# EAGLE design comparator-denary-buffer (EAGLE 9.6.1)
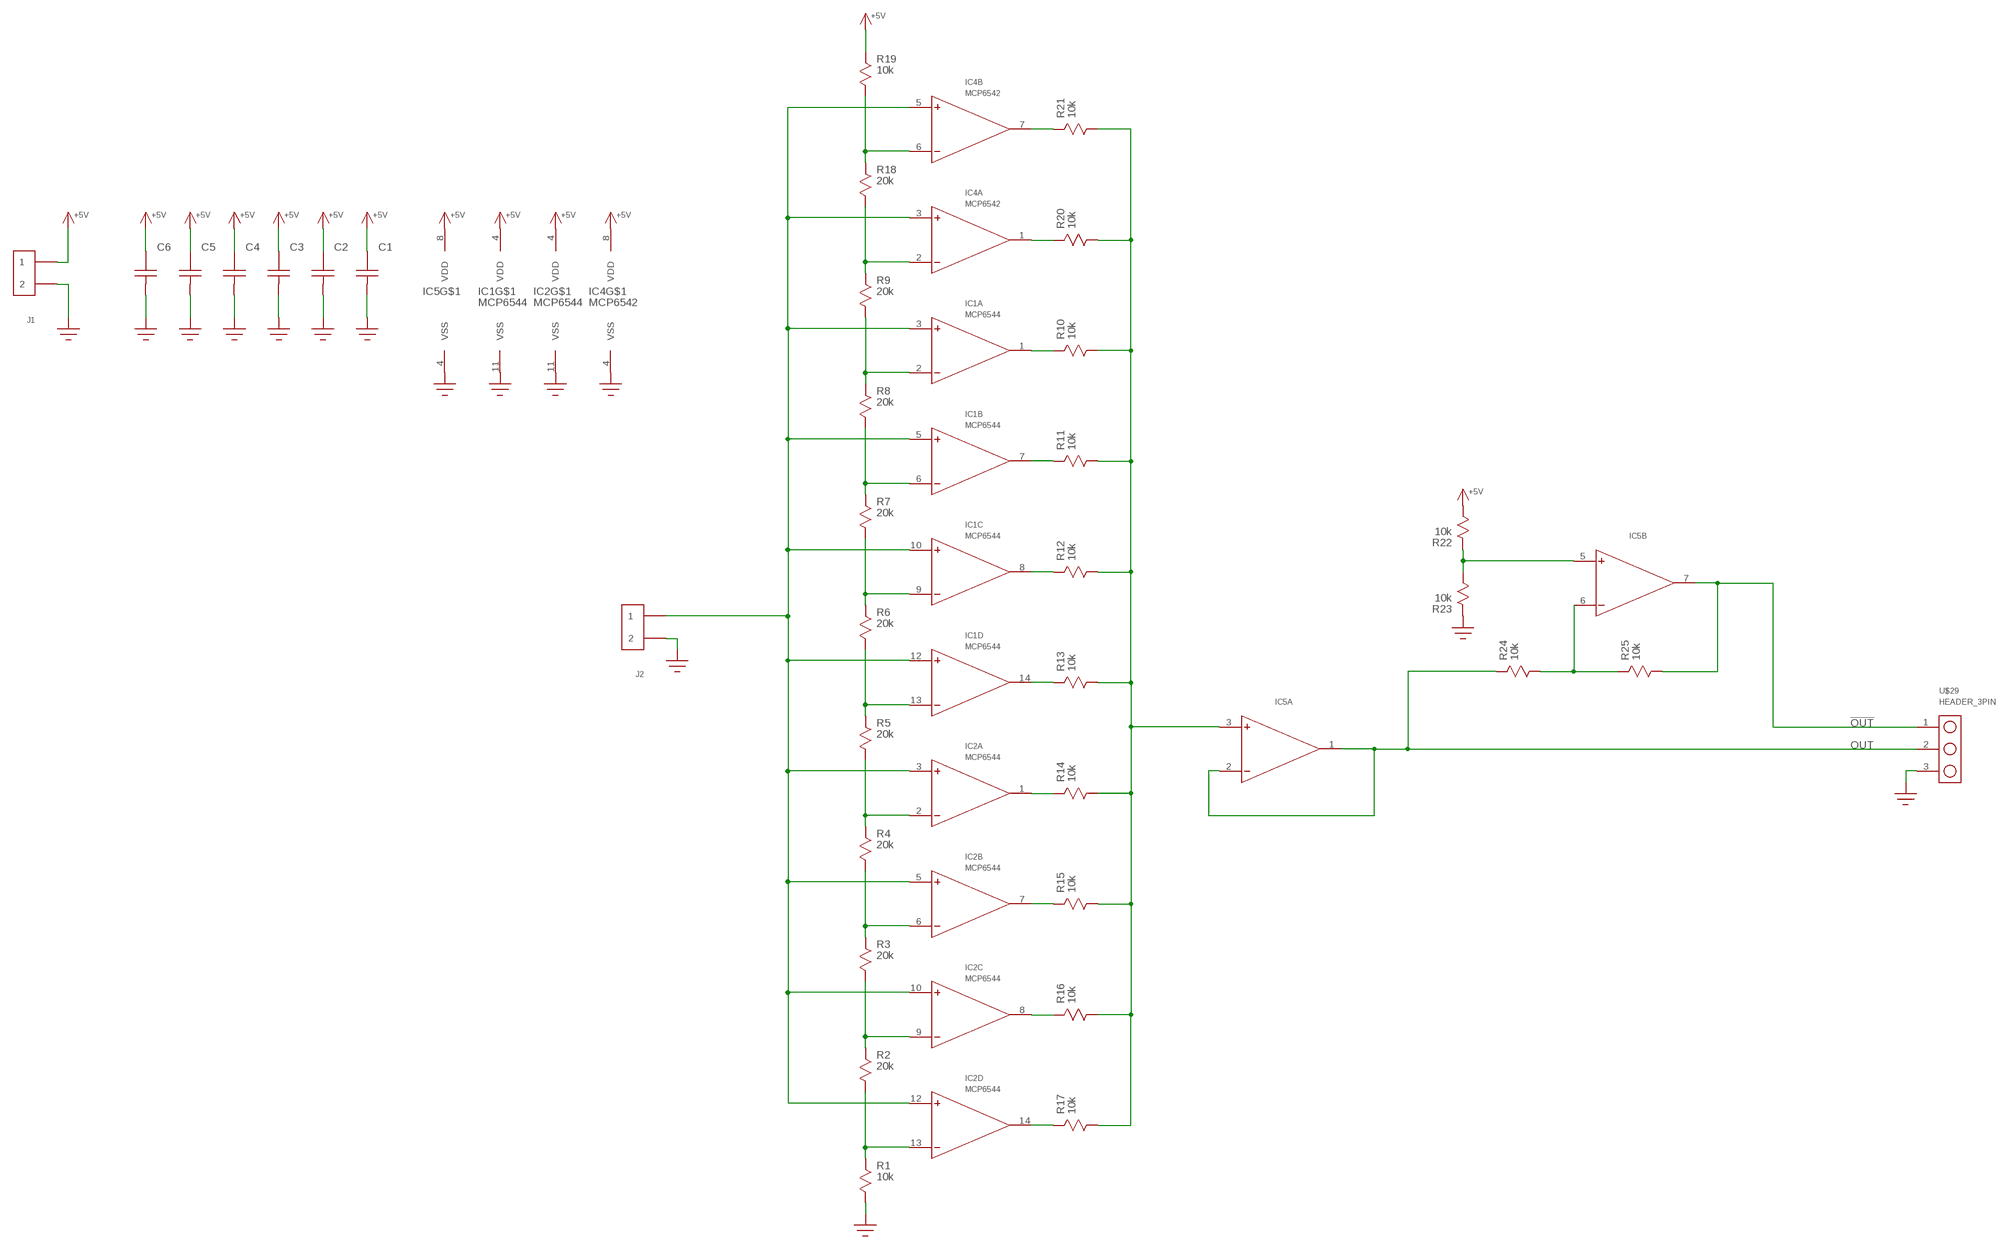
[diagram p0: schematic, sheet 1]

## Parts
C1  C0603  [C0603]
C2  C0603  [C0603]
C3  C0603  [C0603]
C4  C0603  [C0603]
C5  C0603  [C0603]
C6  C1206  [1206]
IC1  MCP6544  MCP6544SOIC  [SOIC-14]
IC2  MCP6544  MCP6544SOIC  [SOIC-14]
IC4  MCP6542  [SOIC8]
IC5  MCP6L02  [SOIC8]
J1  HEADER_2PIN  [HEADER_2PIN]
J2  HEADER_2PIN  [HEADER_2PIN]
R1  10k  R0603  [R0603]
R2  20k  R0603  [R0603]
R3  20k  R0603  [R0603]
R4  20k  R0603  [R0603]
R5  20k  R0603  [R0603]
R6  20k  R0603  [R0603]
R7  20k  R0603  [R0603]
R8  20k  R0603  [R0603]
R9  20k  R0603  [R0603]
R10  10k  R0603  [R0603]
R11  10k  R0603  [R0603]
R12  10k  R0603  [R0603]
R13  10k  R0603  [R0603]
R14  10k  R0603  [R0603]
R15  10k  R0603  [R0603]
R16  10k  R0603  [R0603]
R17  10k  R0603  [R0603]
R18  20k  R0603  [R0603]
R19  10k  R0603  [R0603]
R20  10k  R0603  [R0603]
R21  10k  R0603  [R0603]
R22  10k  R0603  [R0603]
R23  10k  R0603  [R0603]
R24  10k  R0603  [R0603]
R25  10k  R0603  [R0603]
U$29  HEADER_3PIN  [HEADER_3PIN]

## Nets
!OUT!: IC5.7(B:OUT) R25.P$2 U$29.1
+5V: C1.P$2 C2.P$2 C3.P$2 C4.P$2 C5.P$2 C6.P$2 IC1.4(VDD) IC2.4(VDD) IC4.8(VDD) IC5.8(VDD) J1.1 R19.P$1 R22.P$2
GND: C1.P$1 C2.P$1 C3.P$1 C4.P$1 C5.P$1 C6.P$1 IC1.11(VSS) IC2.11(VSS) IC4.4(VSS) IC5.4(VSS) J1.2 J2.2 R1.P$2 R23.P$1 U$29.3
N$1: IC2.13(D:-) R1.P$1 R2.P$2
N$2: IC2.14(D:OUT) R17.P$1
N$3: IC2.9(C:-) R2.P$1 R3.P$2
N$4: IC2.8(C:OUT) R16.P$1
N$5: IC2.6(B:-) R3.P$1 R4.P$2
N$6: IC2.2(A:-) R4.P$1 R5.P$2
N$7: IC1.13(D:-) R5.P$1 R6.P$2
N$8: IC1.9(C:-) R6.P$1 R7.P$2
N$9: IC1.6(B:-) R7.P$1 R8.P$2
N$10: IC2.7(B:OUT) R15.P$1
N$11: IC2.1(A:OUT) R14.P$1
N$13: IC1.14(D:OUT) R13.P$1
N$14: IC1.8(C:OUT) R12.P$1
N$15: IC1.2(A:-) R8.P$1 R9.P$2
N$16: IC1.7(B:OUT) R11.P$1
N$17: IC1.1(A:OUT) R10.P$1
N$19: IC5.3(A:+) R10.P$2 R11.P$2 R12.P$2 R13.P$2 R14.P$2 R15.P$2 R16.P$2 R17.P$2 R20.P$2 R21.P$2
N$20: IC4.2(A:-) R9.P$1 R18.P$2
N$21: IC4.6(B:-) R18.P$1 R19.P$2
N$22: IC4.7(B:OUT) R21.P$1
N$23: IC4.1(A:OUT) R20.P$1
N$24: IC5.5(B:+) R22.P$1 R23.P$2
N$25: IC5.6(B:-) R24.P$2 R25.P$1
OUT: IC5.1(A:OUT) IC5.2(A:-) R24.P$1 U$29.2
VIN: IC1.3(A:+) IC1.5(B:+) IC1.10(C:+) IC1.12(D:+) IC2.3(A:+) IC2.5(B:+) IC2.10(C:+) IC2.12(D:+) IC4.3(A:+) IC4.5(B:+) J2.1

## Library data of the parts
C1-C6 = yapo:C
IC1 IC2 = yapo:MCP6544
IC4 = yapo:MCP6542
IC5 = yapo:MCP6L02
J1 J2 = yapo:HEADER_2PIN
R1-R25 = yapo:R
U$29 = yapo:HEADER_3PIN

## Board
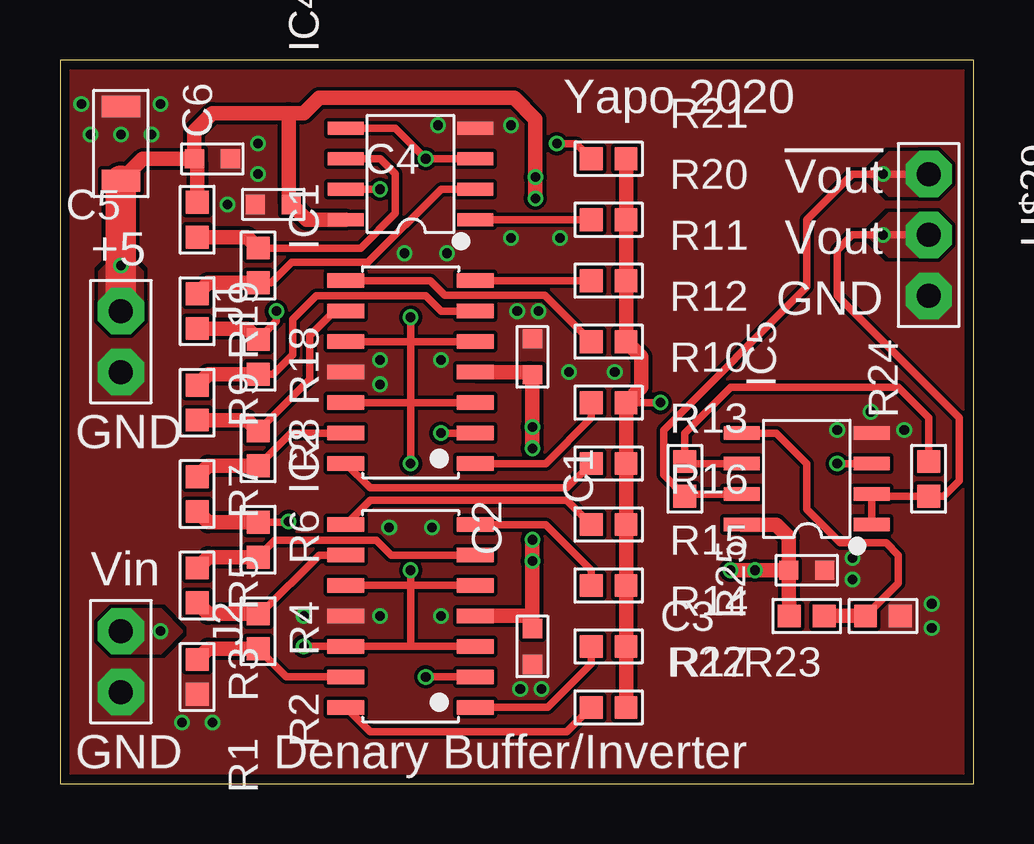
[diagram p1: board, top side]
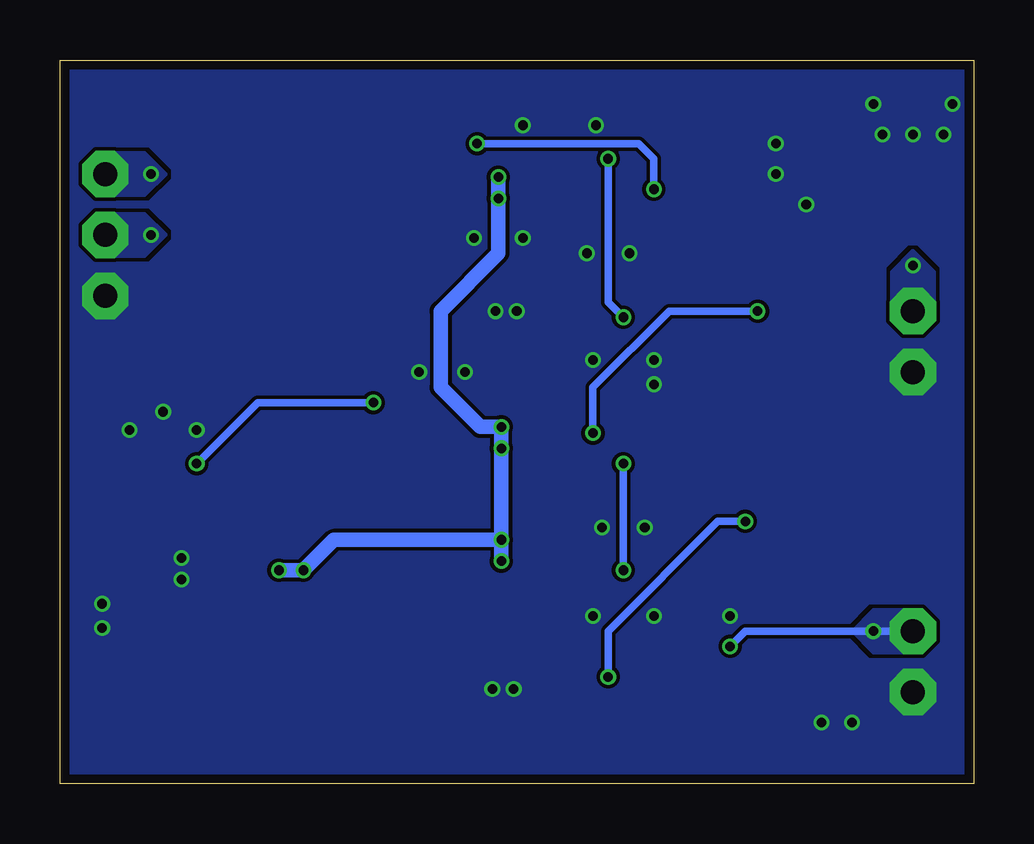
[diagram p2: board, bottom side, seen from below]

Size 38.08 x 30.15 mm. Coordinates in mm from the lower left corner, seen from the top.
Outline: 0,0 38.08,0 38.08,30.15 0,30.15 0,0
Copper layers (1*16): Top 0.035559375mm / dielectric 1.6mm / Bottom 0.035559375mm
Design rules "oshpark-2layer *": minimum track width 6mil, minimum drill 10mil, track to track 6mil, track to pad 6mil, pad to pad 6mil, via to via 6mil, smd to smd 6mil, copper to edge 15mil, drill to drill 6mil, minimum pad ring 5mil, minimum via ring 5mil, stop-mask expansion 2.5mil, vias tented up to drill 20mil, thermal gap 10mil

### Footprints (pad centres in the part's own frame; a part is rotated, then mirrored left to right if it is on the bottom)
C0603 = smd 0.8 x 0.8: P$1 -0.75,0; P$2 0.75,0
1206 = smd 0.9 x 1.6: P$1 -1.55,0; P$2 1.55,0
SOIC-14 = smd 0.6 x 1.55: 1 -3.81,-2.7; 2 -2.54,-2.7; 3 -1.27,-2.7; 4 0,-2.7; 5 1.27,-2.7; 6 2.54,-2.7; 7 3.81,-2.7; 8 3.81,2.7; 9 2.54,2.7; 10 1.27,2.7; 11 0,2.7; 12 -1.27,2.7; 13 -2.54,2.7; 14 -3.81,2.7
SOIC8 = smd 0.55 x 1.5: 1 -1.905,-2.7; 2 -0.635,-2.7; 3 0.635,-2.7; 4 1.905,-2.7; 5 1.905,2.7; 6 0.635,2.7; 7 -0.635,2.7; 8 -1.905,2.7
HEADER_2PIN = drill 1 pad 1.93 octagon: 1 -1.27,0; 2 1.27,0
R0603 = smd 0.95 x 0.95: P$1 -0.725,0; P$2 0.725,0
HEADER_3PIN = drill 1 pad 1.93 octagon: 1 -2.54,0; 2 0,0; 3 2.54,0

### Placement (x,y rotation side)
C1  19.68,17.78 270 top
C2  19.68,5.71 90 top
C3  31.11,8.89 180 top
C4  8.89,24.13 0 top
C5  6.35,26.04 180 top
C6  2.54,26.67 270 top
IC1  14.61,17.14 90 top
IC2  14.61,6.99 90 top
IC4  14.61,25.4 90 top
IC5  31.11,12.7 90 top
J1  2.54,18.41 270 top
J2  2.54,5.08 270 top
R1  5.71,4.45 270 top
R2  8.26,6.35 270 top
R3  5.71,8.26 270 top
R4  8.26,10.16 270 top
R5  5.71,12.06 270 top
R6  8.26,13.97 270 top
R7  5.71,15.88 270 top
R8  8.26,17.78 270 top
R9  5.71,19.68 270 top
R10  22.86,15.88 0 top
R11  22.86,20.95 0 top
R12  22.86,18.41 0 top
R13  22.86,13.34 0 top
R14  22.86,5.71 0 top
R15  22.86,8.26 0 top
R16  22.86,10.79 0 top
R17  22.86,3.17 0 top
R18  8.26,21.59 270 top
R19  5.71,23.5 270 top
R20  22.86,23.5 0 top
R21  22.86,26.04 0 top
R22  31.11,6.99 180 top
R23  34.29,6.99 180 top
R24  36.2,12.7 90 top
R25  26.04,12.7 270 top
U$29  36.2,22.86 270 top

### Tracks (layer width: path | path; a pad name or v marks a point on that pad's centre or on a via)
!OUT!  (via drill 0.4)
  Top 0.305: IC5.7 26.12,12.06 R25.P$2 25.15,12.86 25.15,14.73 31.11,20.7 31.11,23.5 33.02,25.4 v34.29,25.4 U$29.1
  pour Top (no thermals): 36.2,26.29 34.54,26.29 33.66,25.4 34.54,24.51 36.2,24.51
  pour Bottom (no thermals): 36.2,26.29 34.54,26.29 33.66,25.4 34.54,24.51 36.2,24.51
+5V  (via drill 0.4)
  Top 0.61: IC1.4 19.57,17.14 C1.P$2 v19.68,13.97 | IC2.4 19.66,6.99 C2.P$2 v19.68,10.16 | IC4.8 10.28,23.5 C4.P$2 9.53,24.25 9.53,27.94 | C5.P$2 5.71,25.92 R19.P$1 | C5.P$2 5.6,27.19 6.35,27.94 9.53,27.94 | 9.53,27.94 10.16,27.94 10.79,28.57 18.92,28.57 19.81,27.69 v19.81,24.38 | C6.P$2 3.46,26.04 C5.P$2 | C3.P$2 30.36,10.28 29.84,10.79 IC5.8 | C3.P$2 30.36,7.67 30.39,7.64 R22.P$2 | v27.94,8.89 C3.P$2
  Top 1.27: J1.1 v2.54,21.59 C6.P$2
  Bottom 0.61: v19.68,10.16 v19.68,13.97 v19.68,14.86 20.57,14.86 22.23,16.51 22.23,19.68 19.81,22.1 v19.81,24.38 v19.81,25.27 | v19.68,10.16 v19.68,9.27 | v19.68,10.16 26.67,10.16 v27.94,8.89 v28.96,8.89
  pour Top (no thermals): 1.65,19.68 1.65,21.34 2.54,22.23 3.43,21.34 3.43,19.68
  pour Bottom (no thermals): 1.65,19.68 1.65,21.34 2.54,22.23 3.43,21.34 3.43,19.68
GND  (via drill 0.4)
  other vias: 19.05,19.68 19.94,19.68 19.18,3.94 20.07,3.94 8.26,25.4 6.99,24.13 8.26,26.67 5.08,2.54 6.35,2.54 13.34,6.99 10.16,6.99 13.34,17.65 15.75,27.43 18.8,27.43 13.34,16.64 15.88,17.65 14.35,22.1 16.13,22.1 15.49,10.67 13.72,10.67 15.88,6.99 2.54,27.05 1.27,27.05 3.81,27.05 0.89,28.32 4.19,28.32 33.02,9.4 33.02,8.51 36.32,7.49 36.32,6.48 32.38,14.73 33.78,15.49 35.18,14.73 18.8,22.73 20.83,22.73 21.21,17.14 23.11,17.14
  pour Top (rank 2, no thermals): -1.91,32.38 40.64,32.38 40.64,-1.91 -1.91,-1.91
  pour Bottom (rank 2, no thermals): -4.45,34.92 43.18,34.92 43.18,-4.45 -4.45,-4.45
N$1
  Top 0.305: IC2.13 9.44,4.45 R2.P$2
  Top 0.61: R1.P$1 6.17,5.62 R2.P$2
N$2
  Top 0.305: IC2.14 12.92,2.16 21.12,2.16 R17.P$1
N$3
  Top 0.305: IC2.9 10.79,9.53 8.35,7.08 R2.P$1
  Top 0.61: R2.P$1 6.17,7.08 R3.P$2
N$4
  Top 0.305: IC2.8 12.92,11.81 21.12,11.81 R16.P$1
N$5
  Top 0.305: IC2.6 13.79,9.53 13.19,10.13 8.95,10.13 R4.P$2
  Top 0.61: R3.P$1 6.17,9.44 R4.P$2
N$6  (via drill 0.4)
  Top 0.305: R4.P$1 9.36,10.88 9.4,10.92 v9.53,10.92 | v15.24,4.45 IC2.2
  Top 0.61: R4.P$1 6.17,10.88 R5.P$2
  Bottom 0.305: v9.53,10.92 10.67,10.92 15.24,6.35 v15.24,4.45
N$7
  Top 0.305: IC1.13 9.62,14.61 R6.P$2
  Top 0.61: R5.P$1 6.17,13.24 R6.P$2
N$8
  Top 0.305: R6.P$1 10.41,16.85 10.41,18.67 11.43,19.68 IC1.9
  Top 0.61: R6.P$1 7.8,15.15 R7.P$2
N$9
  Top 0.305: R8.P$2 8.89,17.05 9.7,17.87 9.7,19.36 10.67,20.32 15.24,20.32 15.88,19.68 IC1.6
  Top 0.61: R7.P$1 6.17,17.05 R8.P$2
N$10
  Top 0.305: IC2.7 20.23,10.79 22.14,8.89 R15.P$1
N$11
  Top 0.305: IC2.1 20.32,3.17 22.14,4.99 R14.P$1
N$13
  Top 0.305: IC1.14 12.92,12.32 21.12,12.32 R13.P$1
N$14
  Top 0.305: IC1.8 15.42,20.95 16.02,20.35 20.2,20.35 R12.P$1
N$15  (via drill 0.4)
  Top 0.305: R8.P$1 9.02,19.27 v9.02,19.68 | v15.87,14.61 IC1.2
  Top 0.61: R8.P$1 7.8,18.96 R9.P$2
  Bottom 0.305: v9.02,19.68 12.7,19.68 15.88,16.51 v15.88,14.61 v15.87,14.61
N$16
  Top 0.305: R11.P$1 IC1.7
N$17
  Top 0.305: R10.P$1 22.14,15.24 20.23,13.34 IC1.1
N$19  (via drill 0.4)
  Top 0.305: R10.P$2 v25.02,15.88 | v32.38,13.34 IC5.3
  Top 0.61: R21.P$2 R20.P$2 R11.P$2 R12.P$2 24.22,17.78 24.22,16.51 R10.P$2 R13.P$2 R16.P$2 R15.P$2 R14.P$2 R17.P$2
  Bottom 0.305: v25.02,15.88 29.84,15.88 v32.38,13.34
N$20
  Top 0.305: IC4.2 15.88,24.77 12.83,21.72 9.65,21.72 8.8,20.86 R18.P$2
  Top 0.61: R9.P$1 6.17,20.86 R18.P$2
N$21
  Top 0.305: R18.P$1 12.52,22.32 13.96,23.75 13.96,25.41 13.34,26.04 IC4.6
  Top 0.61: R18.P$1 7.8,22.77 R19.P$2
N$22  (via drill 0.4)
  Top 0.305: IC4.7 v13.33,24.77 v13.34,24.77 | v20.7,26.67 21.5,26.67 R21.P$1
  Bottom 0.305: v13.33,24.77 13.33,26.03 13.97,26.67 v20.7,26.67
N$23
  Top 0.305: R20.P$1 IC4.1
N$24
  Top 0.305: R23.P$2 34.92,8.35 34.92,9.53 34.42,10.03 32.51,10.03 31.11,11.43 31.11,13.34 29.84,14.61 IC5.5
  Top 0.61: R22.P$1 R23.P$2
N$25
  Top 0.305: IC5.6 26.12,13.34 R25.P$1 26.04,14.61 27.94,16.51 34.92,16.51 36.2,15.24 R24.P$2
OUT  (via drill 0.4)
  Top 0.305: IC5.1 IC5.2 33.91,11.97 R24.P$1 36.83,11.97 37.47,12.61 37.47,15.24 32.38,20.32 32.38,22.23 33.02,22.86 v34.29,22.86 U$29.2
  pour Top (no thermals): 36.2,23.75 34.54,23.75 33.66,22.86 34.54,21.97 36.2,21.97
  pour Bottom (no thermals): 36.2,23.75 34.54,23.75 33.66,22.86 34.54,21.97 36.2,21.97
VIN  (via drill 0.4)
  Top 0.305: IC4.5 13.97,27.3 v15.24,26.04 IC4.3 | IC1.5 14.61,18.41 | 14.61,18.41 IC1.10 | IC1.12 14.61,15.88 | 14.61,15.88 IC1.3 | 14.61,18.41 14.61,15.88 | IC2.10 14.61,8.26 | 14.61,8.26 IC2.5 | IC2.3 14.61,5.71 | 14.61,5.71 IC2.12 v10.16,5.71 | 14.61,5.71 14.61,8.26 | 14.61,8.26 v14.61,8.89 | v14.61,13.34 14.61,15.88 | v14.61,19.43 14.61,18.41
  Bottom 0.305: v14.61,8.89 v14.61,13.34 | v15.24,26.04 15.24,20.07 v14.61,19.43 | J2.1 v4.19,6.35 9.53,6.35 v10.16,5.71
  pour Bottom (no thermals): 2.54,7.24 4.19,7.24 5.08,6.35 4.19,5.46 2.54,5.46
  pour Top (no thermals): 2.54,7.24 4.19,7.24 5.08,6.35 4.19,5.46 2.54,5.46

### Text on the board
tPlace: Yapo 2020 | !Vout! | Vout | +5 | GND | GND | Vin | GND | Denary Buffer/Inverter